# Altium project Atmega_board.PrjPcb (part 1 of 3)
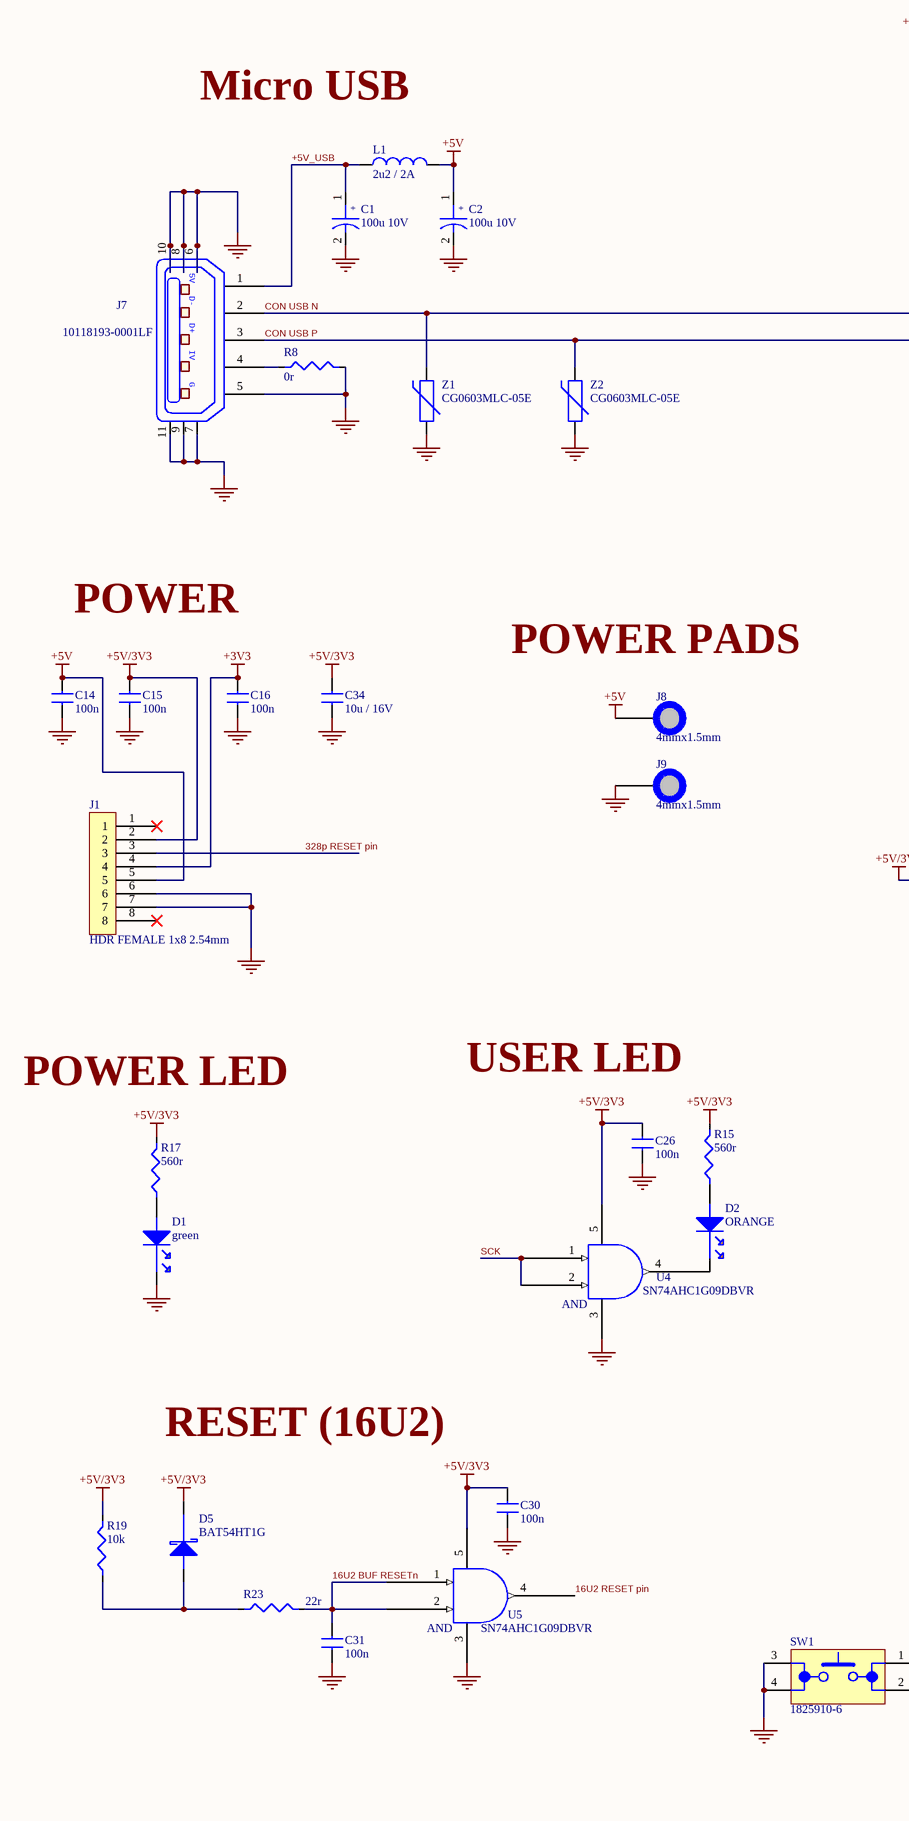
[diagram p0: SCH_Atmega_board.SchDoc, left]
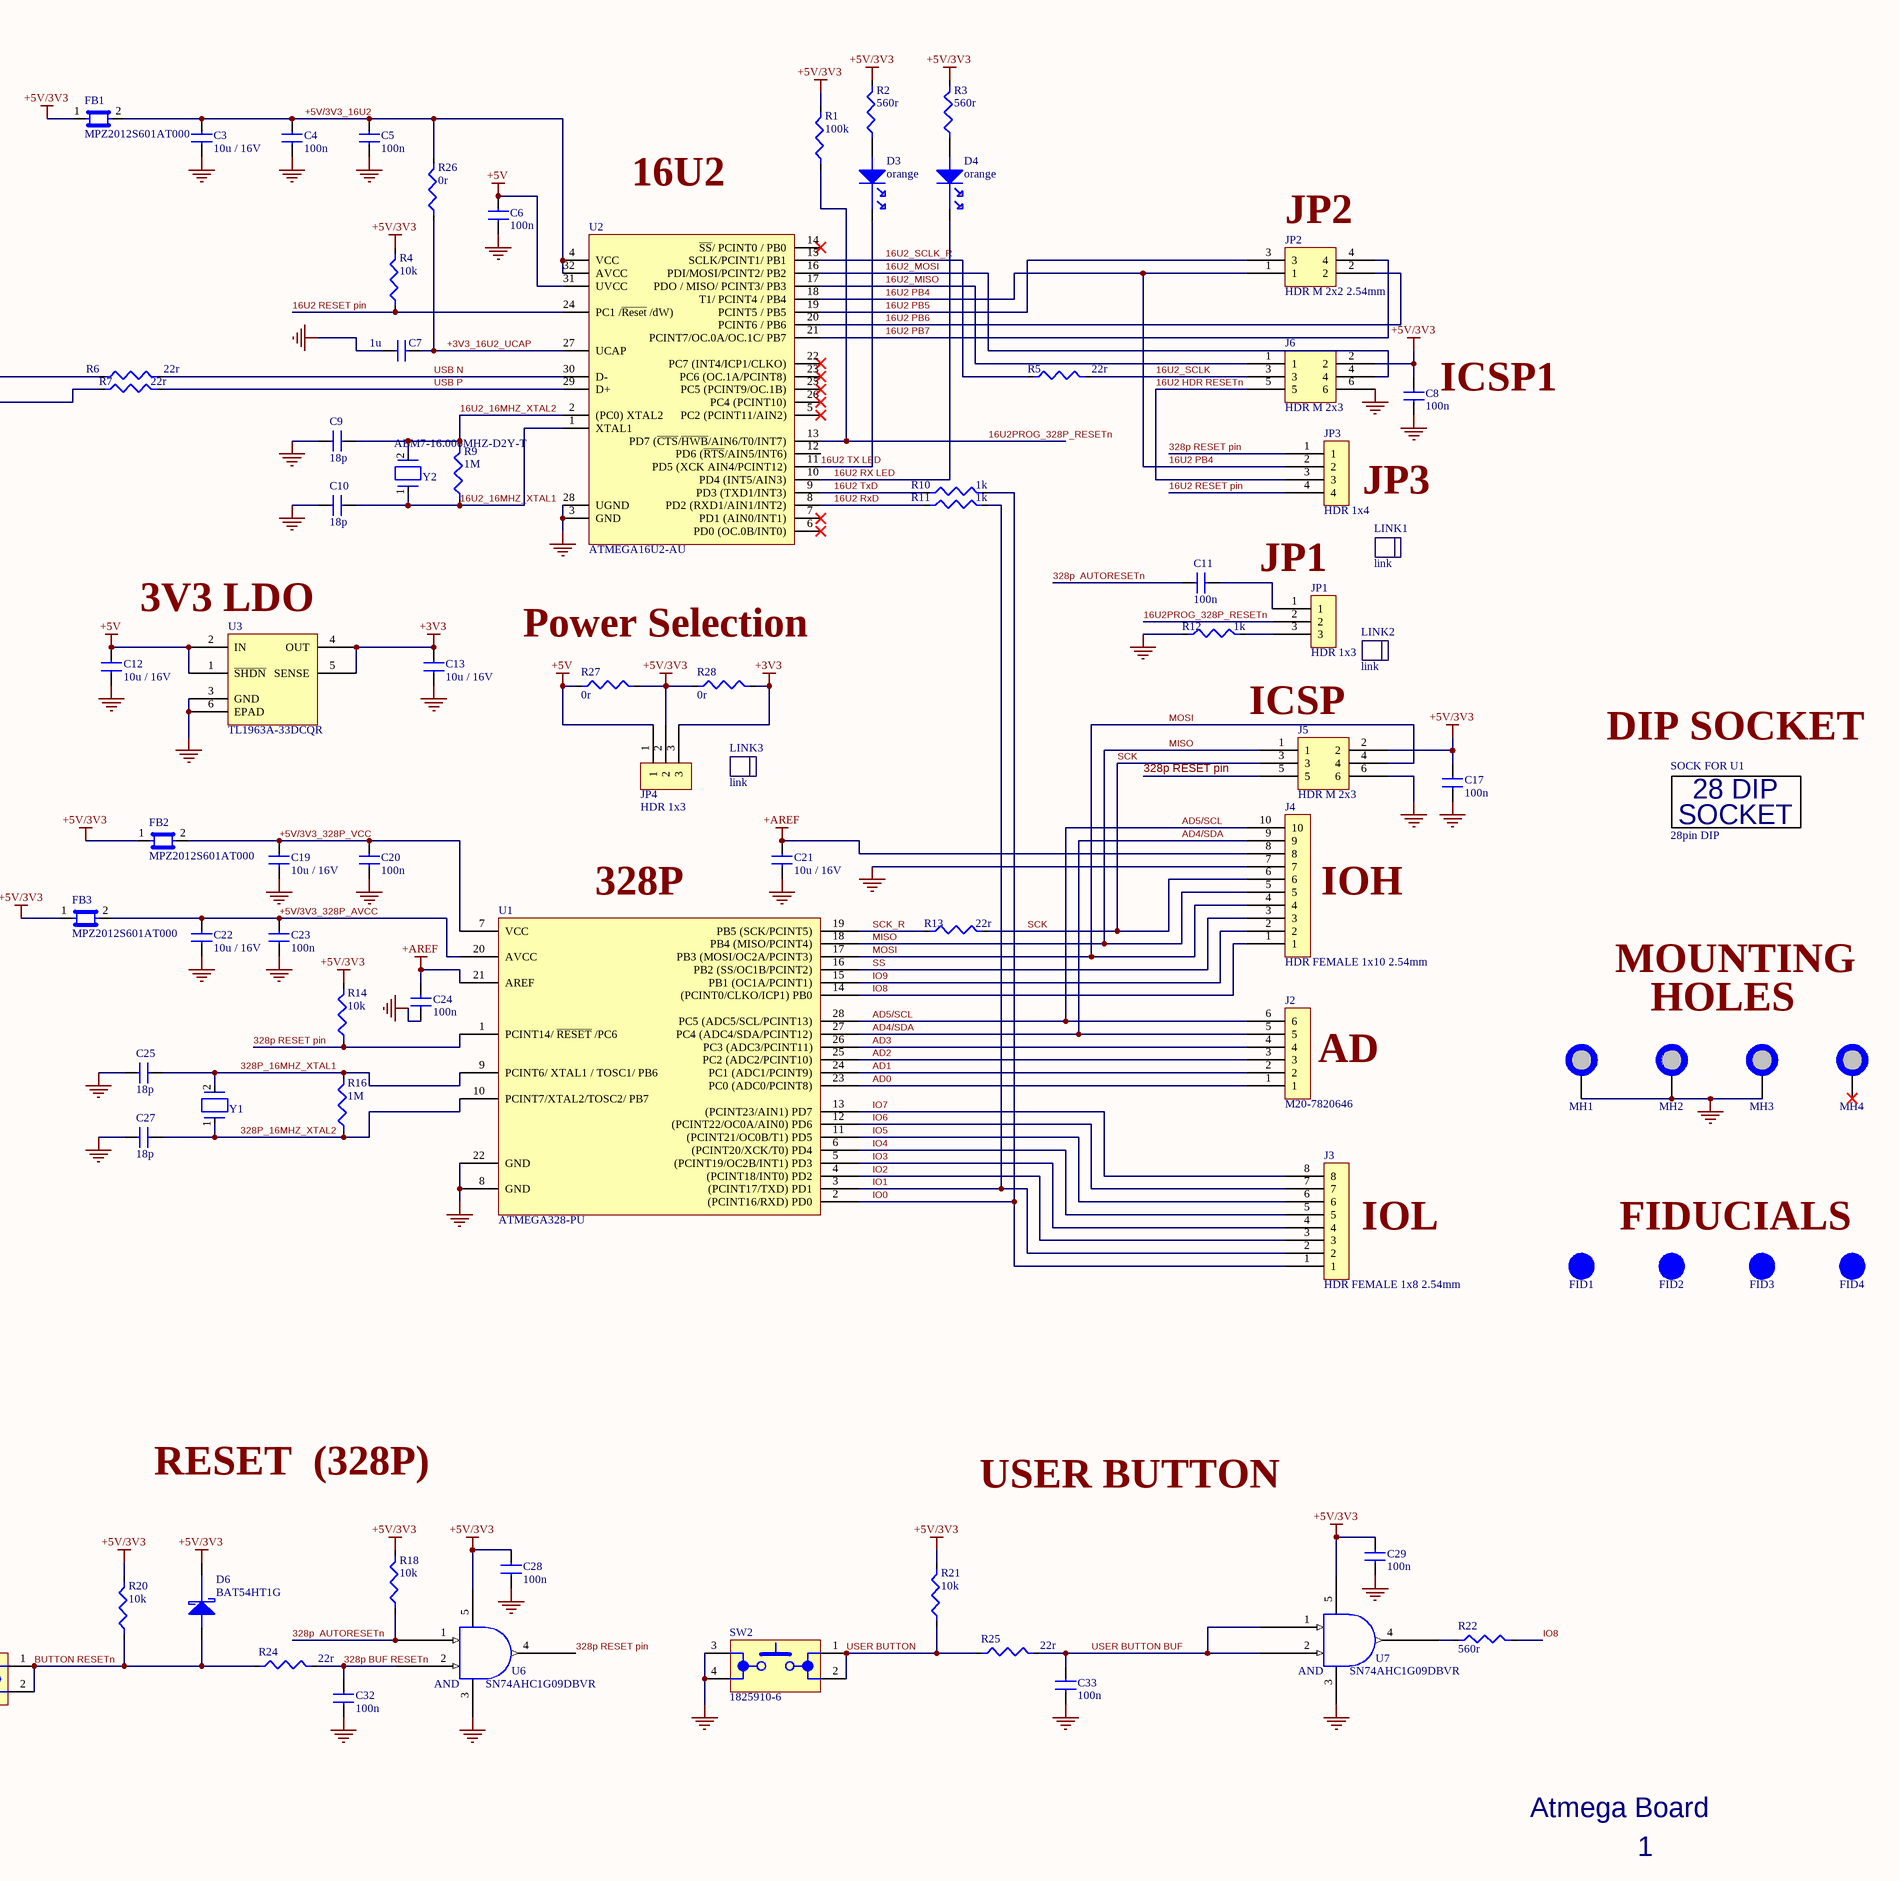
[diagram p1: SCH_Atmega_board.SchDoc, right]
Not fitted: NF; Titile: Atmega board; VersionRevision: V1.1
1 sheet, 109 parts. Net scope: global (net labels, ports and power ports of the same name join across sheets).
Board file: PCB_Atmega_board.PcbDoc

## Sheet SCH_Atmega_board.SchDoc
size A2

### Parts
C1  100u 10V  [C_ALU_C_size]
C2  100u 10V  [C_ALU_C_size]
C3  10u / 16V  [C 0805 10u]
C4  100n  [C 0805]
C5  100n  [C 0805]
C6  100n  [C 0805]
C7  1u  [C 0805]
C8  100n  [C 0805]
C9  18p  [C 0805]
C10  18p  [C 0805]
C11  100n  [C 0805]
C12  10u / 16V  [C 0805 10u]
C13  10u / 16V  [C 0805 10u]
C14  100n  [C 0805]
C15  100n  [C 0805]
C16  100n  [C 0805]
C17  100n  [C 0805]
C19  10u / 16V  [C 0805 10u]
C20  100n  [C 0805]
C21  10u / 16V  [C 0805 10u]
C22  10u / 16V  [C 0805 10u]
C23  100n  [C 0805]
C24  100n  [C 0805]
C25  18p  [C 0805]
C26  100n  [C 0805]
C27  18p  [C 0805]
C28  100n  [C 0805]
C29  100n  [C 0805]
C30  100n  [C 0805]
C31  100n  [C 0805]
C32  100n  [C 0805]
C33  100n  [C 0805]
C34  10u / 16V  [C 0805 10u]
D1  green  [LED 0803]
D2  ORANGE  [LED 0803]
D3  orange  [LED 0803]
D4  orange  [LED 0803]
D5  BAT54HT1G  [SOD323_diode]
D6  BAT54HT1G  [SOD323_diode]
FB1  MPZ2012S601AT000  [EPCOS_MPZ2012_IPC_A]
FB2  MPZ2012S601AT000  [EPCOS_MPZ2012_IPC_A]
FB3  MPZ2012S601AT000  [EPCOS_MPZ2012_IPC_A]
FID1  FID_1mm  [FID_40x120]  (value not drawn)  (no BOM)
FID2  FID_1mm  [FID_40x120]  (value not drawn)  (no BOM)
FID3  FID_1mm  [FID_40x120]  (value not drawn)  (no BOM)
FID4  FID_1mm  [FID_40x120]  (value not drawn)  (no BOM)
J1  HDR FEMALE 1x8 2.54mm  [HDR_F_1x8_2.54mm - duplicate]
J2  M20-7820646  [HDR_F_1x6_2.54mm]
J3  HDR FEMALE 1x8 2.54mm  [HDR_F_1x8_2.54mm - duplicate]
J4  HDR FEMALE 1x10 2.54mm  [HDR_F_1x10_2.54mm - duplicate]
J5  HDR M 2x3  [HDR 2x3 M 2.54mm]
J6  HDR M 2x3  [HDR 2x3 M 2.54mm]
J7  10118193-0001LF  [10118193]
J8  4mmx1.5mm  [PAD_WITH_HOLE_4mm_1.5mm]  (no BOM)
J9  4mmx1.5mm  [PAD_WITH_HOLE_4mm_1.5mm]  (no BOM)
JP1  HDR 1x3  [HDR_F_1x3_2.54mm]
JP2  HDR M 2x2 2.54mm  [HDR 2x2 M 2.54mm]
JP3  HDR 1x4  [HDR_F_1x4_2.54mm]
JP4  HDR 1x3  [HDR_F_1x3_2.54mm]
L1  2u2 / 2A  [C1210_IND]
LINK1  link  (mechanical)
LINK2  link  (mechanical)
LINK3  link  (mechanical)
MH1  MH_7.4MMC_3.2MMD  [MH7_7.4mmD_3.2mmD]  (value not drawn)  (no BOM)
MH2  MH_7.4MMC_3.2MMD  [MH7_7.4mmD_3.2mmD]  (value not drawn)  (no BOM)
MH3  MH_7.4MMC_3.2MMD  [MH7_7.4mmD_3.2mmD]  (value not drawn)  (no BOM)
MH4  MH 7.4 NON Plated  [MH_7.4 3.2_non copper no plated]  (value not drawn)  (no BOM)
R1  100k  [R0805]
R2  560r  [R0805]
R3  560r  [R0805]
R4  10k  [R0805]
R5  22r  [R0805]
R6  22r  [R0805]
R7  22r  [R0805]
R8  0r  [R0805]
R9  1M  [R0805]
R10  1k  [R0805]
R11  1k  [R0805]
R12  1k  [R0805]
R13  22r  [R0805]
R14  10k  [R0805]
R15  560r  [R0805]
R16  1M  [R0805]
R17  560r  [R0805]
R18  10k  [R0805]
R19  10k  [R0805]
R20  10k  [R0805]
R21  10k  [R0805]
R22  560r  [R0805]
R23  22r  [R0805]
R24  22r  [R0805]
R25  22r  [R0805]
R26  0r  [R0805]
R27  0r  [R0805]
R28  0r  [R0805]
SOCK_FOR_U1  28pin DIP  [28 dip 7.62 mm socket]
SW1  1825910-6  [DIP4]
SW2  1825910-6  [DIP4]
U1  ATMEGA328-PU  [ATMEGA328P_DIP]
U2  ATMEGA16U2-AU  [TQFP32]
U3  TL1963A-33DCQR  [DCQ (R-PDSO-G6)]
U4  SN74AHC1G09DBVR  [DBV_SOT_235]
U5  SN74AHC1G09DBVR  [DBV_SOT_235]
U6  SN74AHC1G09DBVR  [DBV_SOT_235]
U7  SN74AHC1G09DBVR  [DBV_SOT_235]
Y1  ABM7-16.000MHZ-D2Y-T  [ABM7_v1_1_BIG]  (value not drawn)
Y2  ABM7-16.000MHZ-D2Y-T  [ABM7_v1_1_BIG]
Z1  CG0603MLC-05E  [R0603]
Z2  CG0603MLC-05E  [R0603]

### Nets
+3V3: C13.2 C16.2 J1.4 JP4.3 R28.2 U3.4(OUT) U3.5(SENSE)
+5V: C2.1 C6.2 C12.2 C14.2 J1.5 J8.1 JP4.1 L1.2 R27.1 U2.31(UVCC) U3.1(~{SHDN}) U3.2(IN)
+5V/3V3: C8.2 C15.2 C17.2 C26.2 C28.2 C29.2 C30.2 C34.2 D5.2(Cathode) D6.2(Cathode) FB1.1 FB2.1 FB3.1 J1.2 J5.2 J6.2 JP4.2 R1.2 R2.2 R3.2 R4.2 R14.2 R15.2 R17.2 R18.2 R19.2 R20.2 R21.2 R27.2 R28.1 U4.5 U5.5 U6.5 U7.5
+AREF: C21.2 C24.2 J4.8 U1.21(AREF)
GND: C1.2 C2.2 C3.1 C4.1 C5.1 C6.1 C7.1 C8.1 C9.1 C10.1 C12.1 C13.1 C14.1 C15.1 C16.1 C17.1 C19.1 C20.1 C21.1 C22.1 C23.1 C24.1 C25.1 C26.1 C27.1 C28.1 C29.1 C30.1 C31.1 C32.1 C33.1 C34.1 D1.2(Cathode) J1.6 J1.7 J4.7 J5.6 J6.6 J7.5 J7.6 J7.7 J7.8 J7.9 J7.10 J7.11 J9.1 MH1.1 MH2.1 MH3.1 R8.2 R12.1 SW1.3 SW1.4 SW2.3 SW2.4 U1.8(GND) U1.22(GND) U2.3(GND) U2.28(UGND) U3.3(GND) U3.6(EPAD) U4.3 U5.3 U6.3 U7.3 Z1.1 Z2.1
16U2 BUF RESETn: C31.2 R23.2 U5.1 U5.2
16U2 HDR RESETn: J6.5 JP3.3
16U2 PB4: JP2.1 JP3.2 U2.18(T1/_PCINT4_/_PB4)
16U2 PB5: JP2.3 U2.19(PCINT5_/_PB5)
16U2 PB6: JP2.2 U2.20(PCINT6_/_PB6)
16U2 PB7: JP2.4 U2.21(PCINT7/OC.0A/OC.1C/_PB7)
16U2 RESET pin: JP3.4 R4.1 U2.24(PC1_/~{Reset}_/dW)) U5.4
16U2 RX LED: D4.2(Cathode) U2.10(PD4_(INT5/AIN3))
16U2 RxD: R11.1 U2.8(PD2_(RXD1/AIN1/INT2))
16U2 TX LED: D3.2(Cathode) U2.11(PD5_(XCK_AIN4/PCINT12))
16U2 TxD: R10.1 U2.9(PD3_(TXD1/INT3))
16U2_16MHZ_XTAL1: C10.2 R9.1 U2.1(XTAL1) Y2.1
16U2_16MHZ_XTAL2: C9.2 R9.2 U2.2((PC0)_XTAL2) Y2.2
16U2_MISO: J6.1 U2.17(PDO_/_MISO/_PCINT3/_PB3)
16U2_MOSI: J6.4 U2.16(PDI/MOSI/PCINT2/_PB2)
16U2_SCLK: J6.3 R5.2
16U2_SCLK_R: R5.1 U2.15(SCLK/PCINT1/_PB1)
16U2PROG_328P_RESETn: JP1.2 R1.1 U2.13(PD7_(~{CTS}/~{HWB}/AIN6/T0/INT7))
328p  AUTORESETn: C11.1 R18.1 U6.1
328p BUF RESETn: C32.2 R24.2 U6.2
328p RESET pin: J1.3 J5.5 JP3.1 R14.1 U1.1(PCINT14/_~{RESET}_/PC6) U6.4
328P_16MHZ_XTAL1: C25.2 R16.2 U1.9(PCINT6/_XTAL1_/_TOSC1/_PB6) Y1.2
328P_16MHZ_XTAL2: C27.2 R16.1 U1.10(PCINT7/XTAL2/TOSC2/_PB7) Y1.1
+3V3_16U2_UCAP: C7.2 R26.1 U2.27(UCAP)
+5V/3V3_16U2: C3.2 C4.2 C5.2 FB1.2 R26.2 U2.4(VCC) U2.32(AVCC)
+5V/3V3_328P_AVCC: C22.2 C23.2 FB3.2 U1.20(AVCC)
+5V/3V3_328P_VCC: C19.2 C20.2 FB2.2 U1.7(VCC)
+5V_USB: C1.1 J7.1 L1.1
AD0: J2.1 U1.23(PC0_(ADC0/PCINT8))
AD1: J2.2 U1.24(PC1_(ADC1/PCINT9))
AD2: J2.3 U1.25(PC2_(ADC2/PCINT10))
AD3: J2.4 U1.26(PC3_(ADC3/PCINT11))
AD4/SDA: J2.5 J4.9 U1.27(PC4_(ADC4/SDA/PCINT12))
AD5/SCL: J2.6 J4.10 U1.28(PC5_(ADC5/SCL/PCINT13))
BUTTON RESETn: D6.1(Anode) R20.1 R24.1 SW1.1 SW1.2
CON USB N: J7.2 R6.1 Z1.2
CON USB P: J7.3 R7.1 Z2.2
IO0: J3.1 R10.2 U1.2((PCINT16/RXD)_PD0)
IO1: J3.2 R11.2 U1.3((PCINT17/TXD)_PD1)
IO2: J3.3 U1.4((PCINT18/INT0)_PD2)
IO3: J3.4 U1.5((PCINT19/OC2B/INT1)_PD3)
IO4: J3.5 U1.6((PCINT20/XCK/T0)_PD4)
IO5: J3.6 U1.11((PCINT21/OC0B/T1)_PD5)
IO6: J3.7 U1.12((PCINT22/OC0A/AIN0)_PD6)
IO7: J3.8 U1.13((PCINT23/AIN1)_PD7)
IO8: J4.1 R22.2 U1.14((PCINT0/CLKO/ICP1)_PB0)
IO9: J4.2 U1.15(PB1_(OC1A/PCINT1))
MISO: J4.5 J5.1 U1.18(PB4_(MISO/PCINT4))
MOSI: J4.4 J5.4 U1.17(PB3_(MOSI/OC2A/PCINT3))
SCK: J4.6 J5.3 R13.2 U4.1 U4.2
SCK_R: R13.1 U1.19(PB5_(SCK/PCINT5))
SS: J4.3 U1.16(PB2_(SS/OC1B/PCINT2))
USB N: R6.2 U2.30(D-)
USB P: R7.2 U2.29(D+)
USER BUTTON: R21.1 R25.1 SW2.1 SW2.2
USER BUTTON BUF: C33.2 R25.2 U7.1 U7.2
NetC11_2: C11.2 JP1.1
NetD1_1: D1.1(Anode) R17.1
NetD2_1: D2.1(Anode) R15.1
NetD2_2: D2.2(Cathode) U4.4
NetD3_1: D3.1(Anode) R2.1
NetD4_1: D4.1(Anode) R3.1
NetD5_1: D5.1(Anode) R19.1 R23.1
NetJ7_4: J7.4 R8.1
NetJP1_3: JP1.3 R12.2
NetR22_1: R22.1 U7.4

Not connected (* = marked no-connect by the designer): J1 1* 8*; MH4 1*; U2 5(PC2_(PCINT11/AIN2))* 6(PD0_(OC.0B/INT0))* 7(PD1_(AIN0/INT1))* 12(PD6_(~{RTS}/AIN5/INT6)) 14(~{SS}/_PCINT0_/_PB0)* 22(PC7_(INT4/ICP1/CLKO))* 23(PC6_(OC.1A/PCINT8))* 25(PC5_(PCINT9/OC.1B))* 26(PC4_(PCINT10))*

### Notes on the sheet
- Micro USB
- 16U2
- (near JP2) JP2
- (near C8) ICSP1
- JP3
- JP1
- (near U3) 3V3 LDO
- Power Selection
- POWER
- POWER PADS
- (near J5) ICSP
- DIP SOCKET
- (near U1) 328P
- (near J4) IOH
- MOUNTING
- HOLES
- USER LED
- (near J2) AD
- (near R17) POWER LED
- (near J3) IOL
- FIDUCIALS
- RESET (16U2)
- RESET  (328P)
- USER BUTTON
- Atmega Board
- 1
- (in symbol 4828-3004-CP) 28 DIP; SOCKET
- (in symbol 10118193-0001LF) 5V; D-; D+; IV; G
- (in symbol EEE-1AA101WR) +
- (in symbol SN74AHC1G09DBVR) AND